# EAGLE design TFTBR (EAGLE 9.6.2)
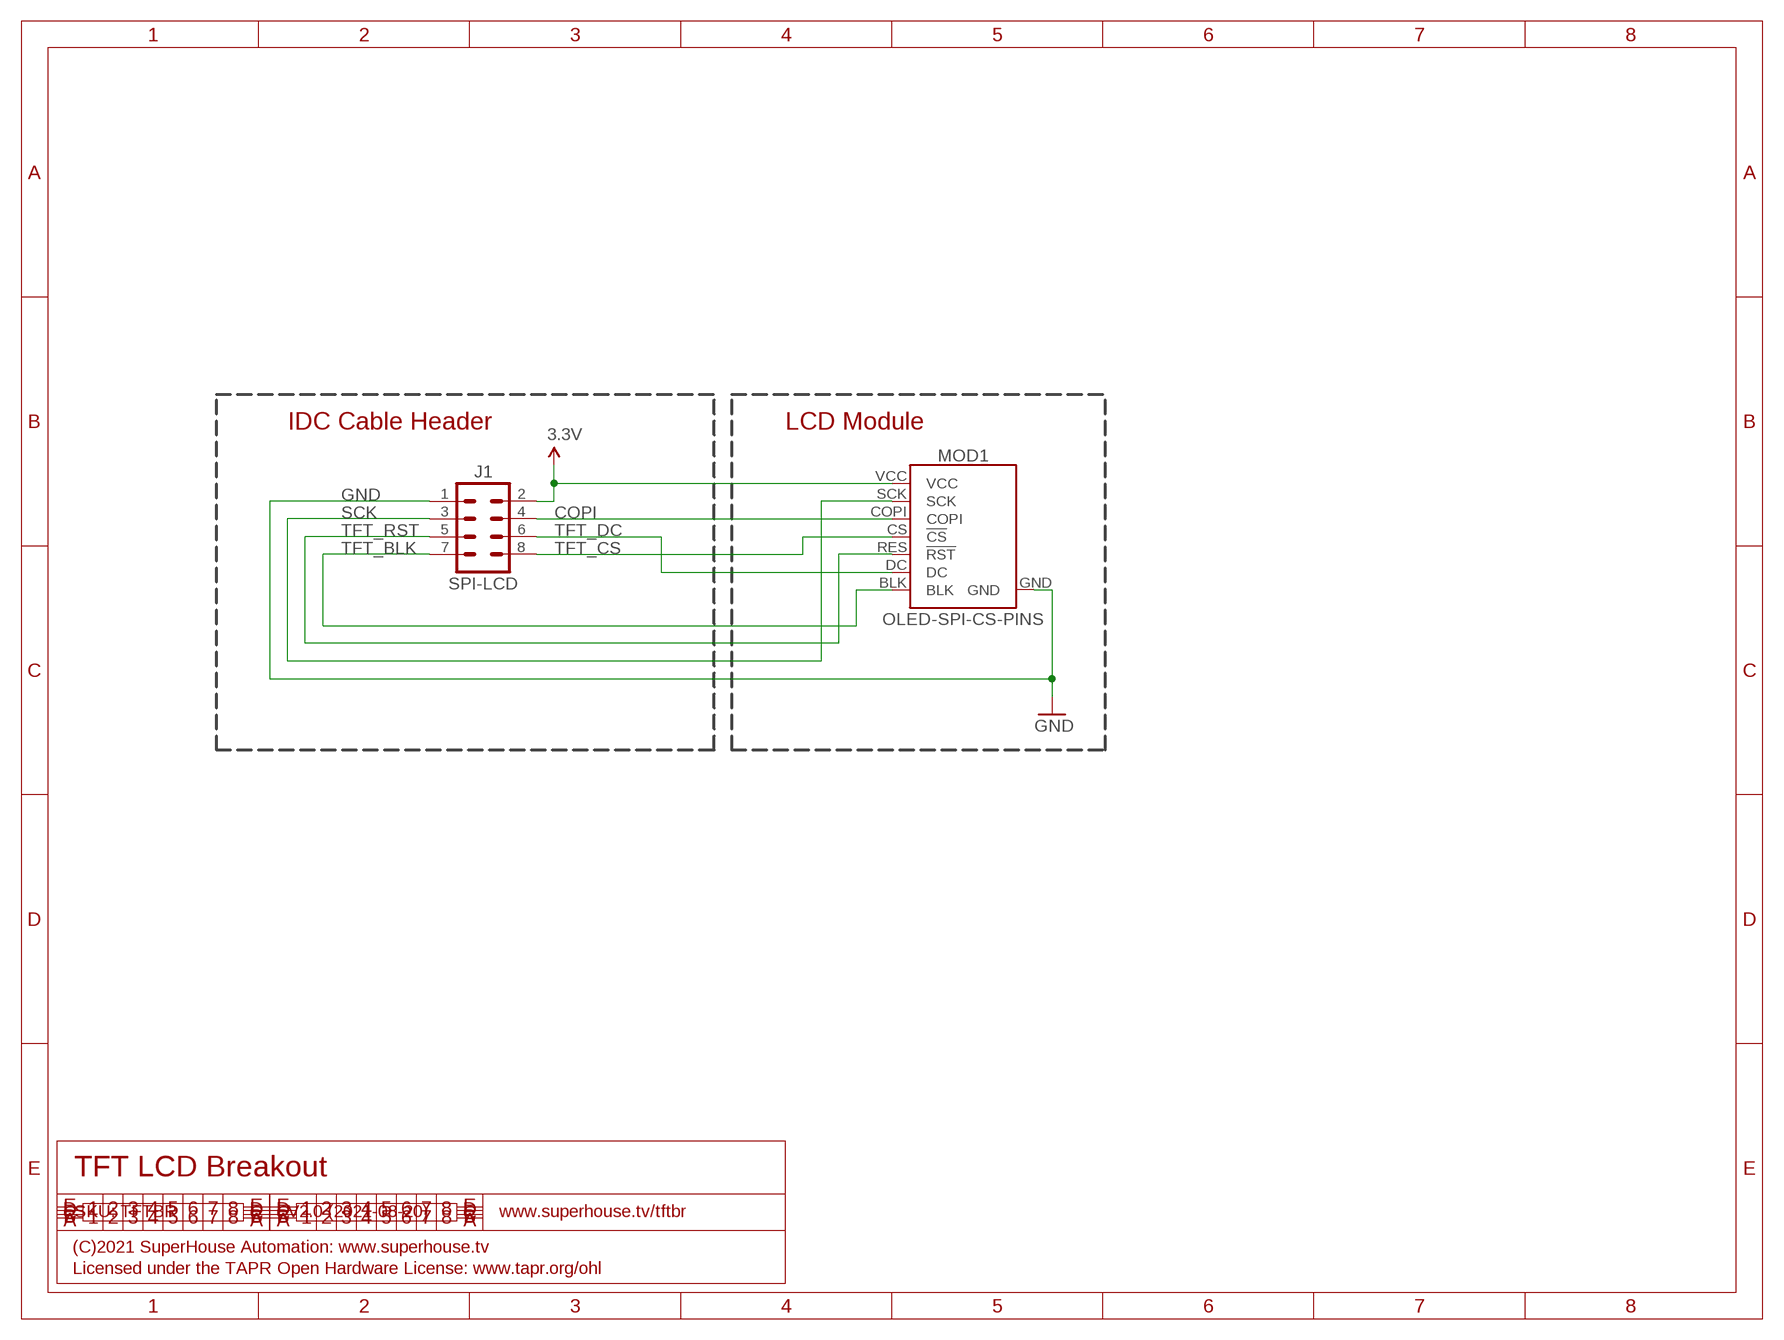
[diagram p0: schematic, sheet 1]

## Parts
J1  SPI-LCD  M02X4-SHROUD  [2X04-2.54-SHROUDED]
MOD1  OLED-SPI-CS-PINS  [OLED-240X240-1.54]

## Nets
3.3V: J1.2 MOD1.VCC
COPI: J1.4 MOD1.COPI
GND: J1.1 MOD1.GND
SCK: J1.3 MOD1.SCK
TFT_BLK: J1.7 MOD1.BLK
TFT_CS: J1.8 MOD1.CS(!CS)
TFT_DC: J1.6 MOD1.DC
TFT_RST: J1.5 MOD1.RES(!RST)

## Notes on the sheet
- IDC Cable Header | LCD Module
- TFT LCD Breakout
- SKU: TFTBR | V2.0 (2021-08-20) | www.superhouse.tv/tftbr
- (C)2021 SuperHouse Automation: www.superhouse.tv
- Licensed under the TAPR Open Hardware License: www.tapr.org/ohl

## Library data of the parts
J1 = SuperHouse-Connectors:M02X4: M08 header in 2x4 format
MOD1 = SuperHouse-Displays:OLED-SPI-CS

## Board
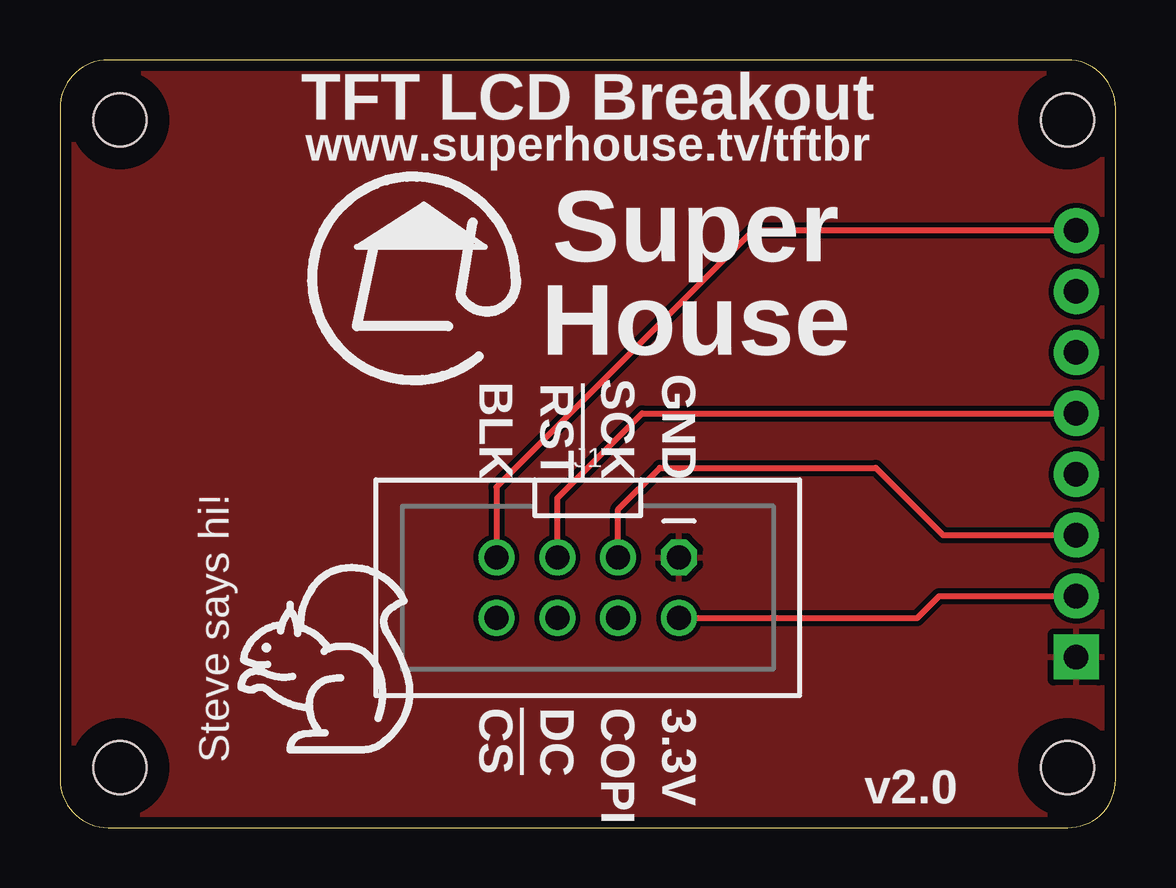
[diagram p1: board, top side]
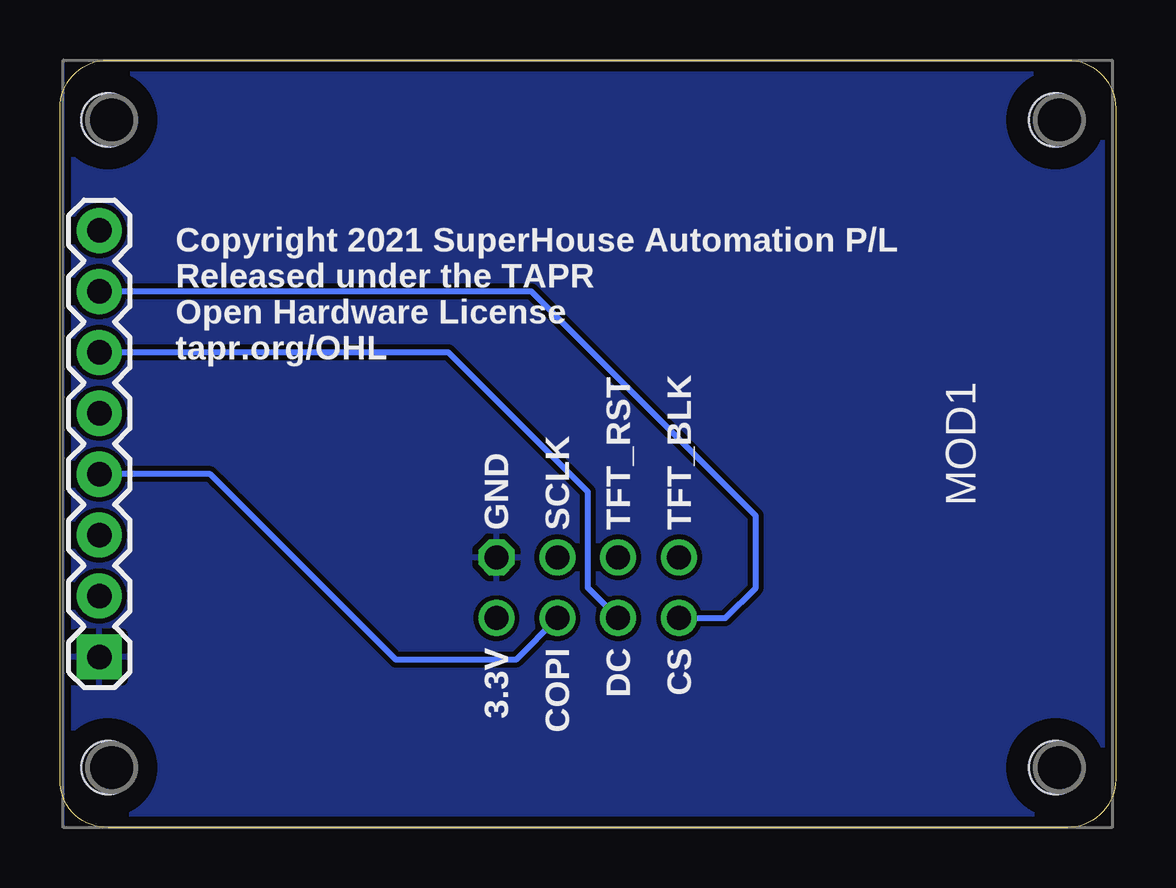
[diagram p2: board, bottom side, seen from below]

Size 44 x 32 mm. Coordinates in mm from the lower left corner, seen from the top.
Outline: 44,30 arc90 42,32 2,32 arc90 0,30 0,2 arc90 2,0 42,0 arc92 44,2 44,30
Copper layers (1*16): Top 0.035mm / dielectric 1.5mm / Bottom 0.035mm
Design rules "SuperHouse-Design-Rules *": minimum track width 10mil, minimum drill 24mil, track to track 8mil, track to pad 8mil, pad to pad 8mil, via to via 8mil, smd to smd 6mil, copper to edge 18mil, drill to drill 8mil, minimum pad ring 7mil, minimum via ring 8mil, stop-mask expansion 4mil, vias tented up to drill 0.5mm, thermal gap 10mil
Holes 2.2 mm at 42,2.5 42,29.5 2.5,2.5 2.5,29.5
tRestrict: area 40,27.5 to 44,31.5; area 40,0.5 to 44,4.5; area 0.5,0.5 to 4.5,4.5; area 0.5,27.5 to 4.5,31.5
bRestrict: area 40,27.5 to 44,31.5; area 40,0.5 to 44,4.5; area 0.5,27.5 to 4.5,31.5; area 0.5,0.5 to 4.5,4.5

### Footprints (pad centres in the part's own frame; a part is rotated, then mirrored left to right if it is on the bottom)
2X04-2.54-SHROUDED = drill 1 octagon: 1 -3.81,-1.27 | drill 1: 2 -3.81,1.27; 3 -1.27,-1.27; 4 -1.27,1.27; 5 1.27,-1.27; 6 1.27,1.27; 7 3.81,-1.27; 8 3.81,1.27
OLED-240X240-1.54 = drill 1.016 pad 1.88: BLK 8.89,20.36; COPI -1.27,20.36; CS 6.35,20.36; DC 3.81,20.36; RES 1.27,20.36; SCK -3.81,20.36; VCC -6.35,20.36 | drill 1.016 pad 1.88 square: GND -8.89,20.36

### Placement (x,y rotation side)
J1  22,10 180 top
MOD1  22,16 90 bottom

### Tracks (layer width: path | path; a pad name or v marks a point on that pad's centre or on a via)
3.3V
  Top 0.254: J1.2 35.73,8.73 36.65,9.65 MOD1.VCC
COPI
  Bottom 0.254: J1.4 25,7 30,7 37.73,14.73 MOD1.COPI
GND
  pour Bottom: 44,2 arc-90 42,0 2,0 arc-90 0,2 0,30 arc-90 2,32 42,32 arc-90 44,30
  pour Top: 44,2 arc-90 42,0 2,0 arc-90 0,2 0,30 arc-90 2,32 42,32 arc-90 44,30
SCK
  Top 0.254: J1.3 23.27,13.27 25,15 34,15 36.81,12.19 MOD1.SCK
TFT_BLK
  Top 0.254: MOD1.BLK 28.89,24.89 18.19,14.19 J1.7
TFT_CS
  Bottom 0.254: J1.8 16.27,8.73 15,10 15,13 24.35,22.35 MOD1.CS
TFT_DC
  Bottom 0.254: J1.6 22,10 22,14 27.81,19.81 MOD1.DC
TFT_RST
  Top 0.254: J1.5 20.73,13.73 24.27,17.27 MOD1.RES

### Text on the board
tPlace: TFT LCD Breakout | www.superhouse.tv/tftbr | Super / House | BLK | !RST | SCK | GND | !CS | DC | COPI | 3.3V | Steve says hi! | v2.0
bPlace: Copyright 2021 SuperHouse Automation P/L / Released under the TAPR / Open Hardware License / tapr.org/OHL | TFT_BLK | TFT_RST | SCLK | GND | CS | DC | COPI | 3.3V
Measures: TFTBR v1.0 Dimensions (mm)